# Altium schematic sheet 01_Block Diagram.SchDoc
size A4
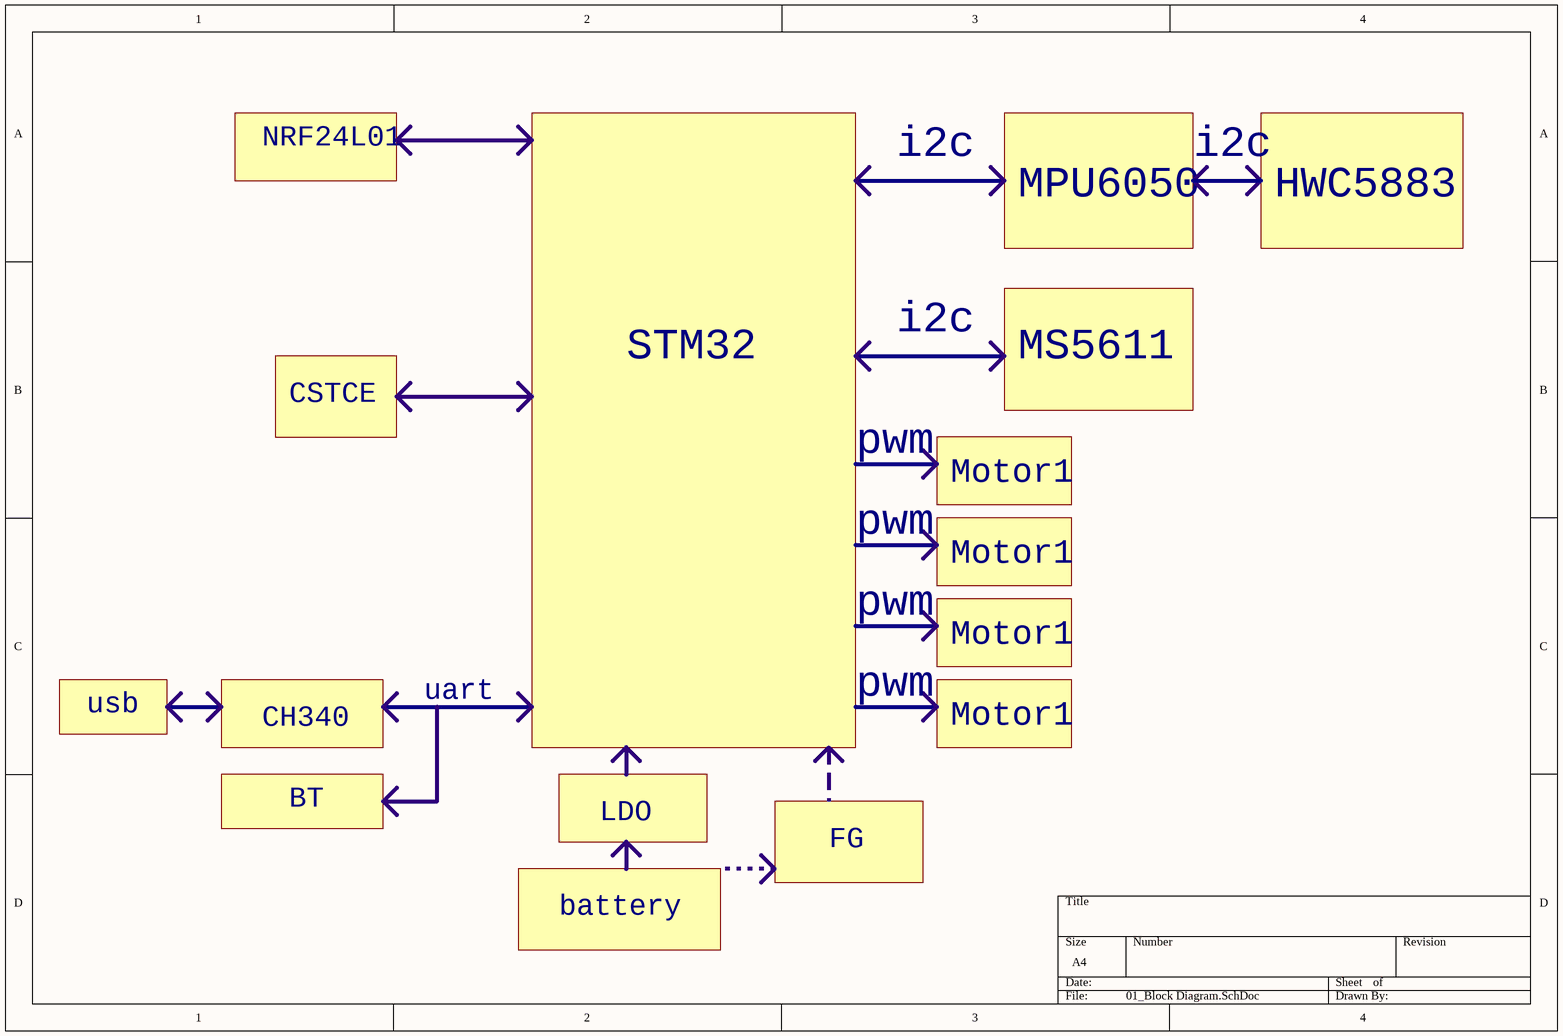
[diagram p0: 01_Block Diagram.SchDoc]

## Notes on the sheet
- NRF24L01
- i2c
- MPU6050
- HWC5883
- STM32
- MS5611
- CSTCE
- pwm
- Motor1
- usb
- uart
- CH340
- BT
- LDO
- FG
- battery